# EAGLE design Openlapse2.6 (EAGLE 7.6.0)
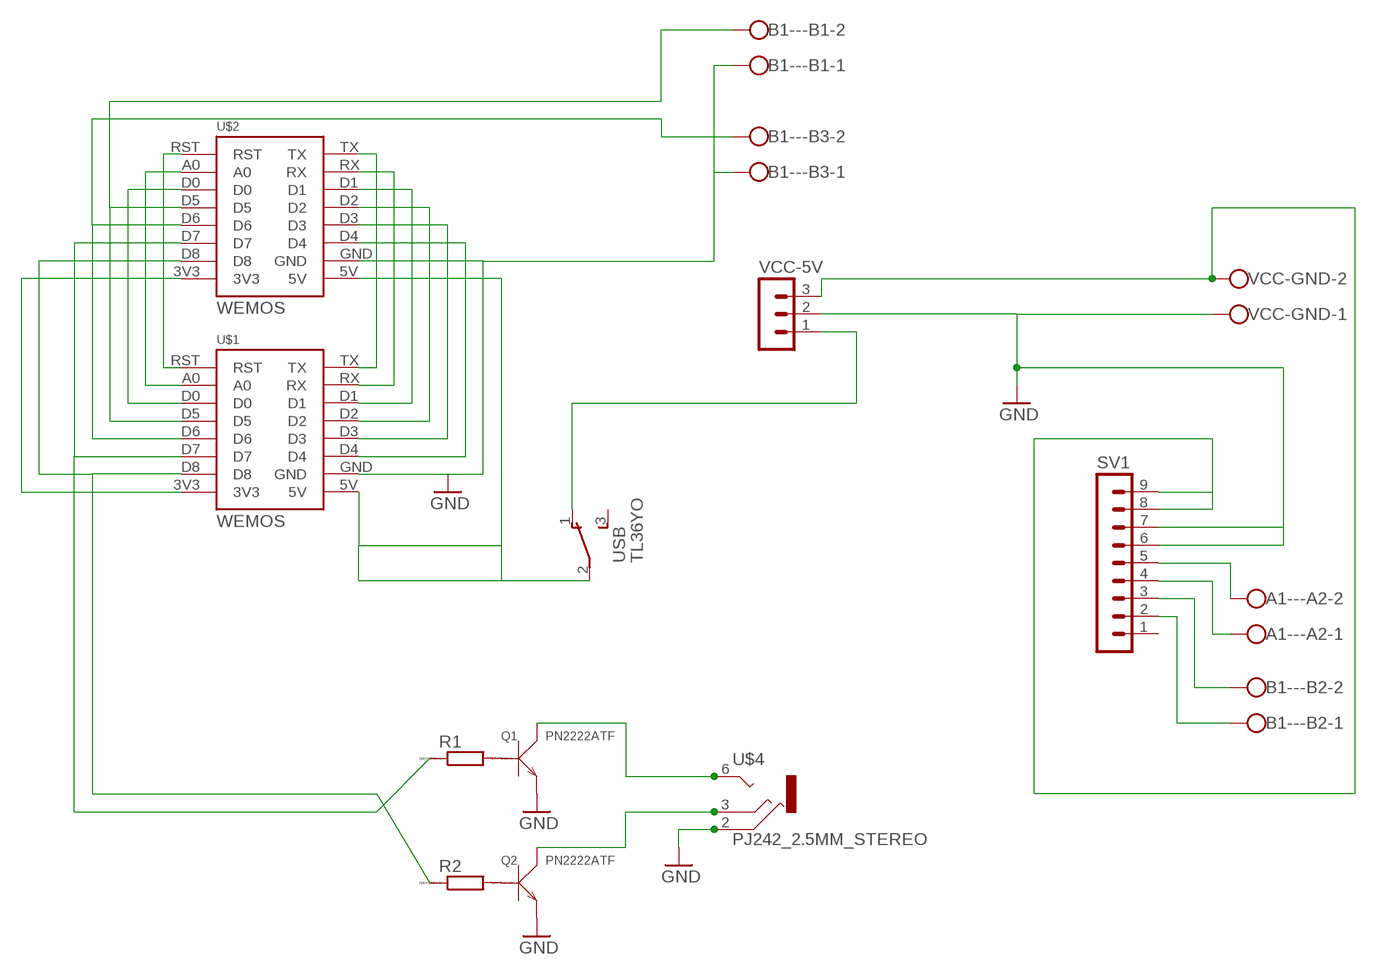
[diagram p0: schematic, sheet 1]

## Parts
A1---A2  W237-102  [W237-102]
B1---B1  W237-102  [W237-102]
B1---B2  W237-102  [W237-102]
B1---B3  W237-102  [W237-102]
Q1  PN2222ATF  DIP-TRANS-NPN-40V-1A-PN2222ATF(TO-92)  [TO-92]
Q2  PN2222ATF  DIP-TRANS-NPN-40V-1A-PN2222ATF(TO-92)  [TO-92]
R1  R0204/7  [0204/7]
R2  R0204/7  [0204/7]
SV1  MA09-1  [MA09-1]
U$1  WEMOS  [WEMOS]
U$2  WEMOS  [WEMOS]
U$4  PJ242_2.5MM_STEREO  [PJ242_2.5MM_STEREO]
USB  TL36YO  [TL3XYO]
VCC-5V  MA03-1  [MA03-1]
VCC-GND  W237-102  [W237-102]

## Nets
GND: B1---B1.1 B1---B3.1 Q1.1(E) Q2.1(E) SV1.6 SV1.7 U$1.GND U$2.GND U$4.2 VCC-5V.2 VCC-GND.1
N$1: SV1.8 SV1.9 VCC-5V.3 VCC-GND.2
N$2: U$1.5V U$2.5V USB.2(P)
N$3: R2.1 U$1.D8 U$2.D8
N$4: R1.1 U$1.D7 U$2.D7
N$5: U$1.TX U$2.TX
N$6: U$1.RX U$2.RX
N$7: Q2.2(B) R2.2
N$8: Q1.2(B) R1.2
N$9: U$1.D1 U$2.D1
N$10: U$1.D2 U$2.D2
N$11: U$1.D3 U$2.D3
N$12: U$1.D4 U$2.D4
N$13: U$1.RST U$2.RST
N$14: U$1.A0 U$2.A0
N$15: U$1.D0 U$2.D0
N$16: B1---B1.2 U$1.D5 U$2.D5
N$17: B1---B3.2 U$1.D6 U$2.D6
N$18: Q1.3(C) U$4.6
N$20: USB.1(O) VCC-5V.1
N$21: U$1.3V3 U$2.3V3
N$22: A1---A2.2 SV1.5
N$23: A1---A2.1 SV1.4
N$24: Q2.3(C) U$4.3
N$25: B1---B2.2 SV1.3
N$26: B1---B2.1 SV1.2
Unconnected: SV1.1 USB.3(S)

## Library data of the parts
A1---A2 B1---B1-B1---B3 VCC-GND = con-wago-500:W237-102: WAGO SCREW CLAMP; MPN: 237-102; OC_FARNELL: unknown; OC_NEWARK: 70K9898
Q1 Q2 = Seeed-OPL-Transistor:DIP-TRANS-NPN-40V-1A-PN2222ATF(TO-92): 305010023; MPN: PN2222ATF
R1 R2 = eagle-ltspice:R: RESISTOR, European symbol; SPICEMODEL: NONE; SPICEPREFIX: R
SV1 = con-lstb:MA09-1: PIN HEADER; OC_FARNELL: unknown; OC_NEWARK: unknown
U$1 U$2 = wemos:WEMOS
U$4 = daves_bits:PJ242_2.5MM_STEREO
USB = switch:TL36YO: TINY SWITCH ON - ON Source: http://www2.produktinfo.conrad.com/datenblaetter/700000-724999/705152-da-01-de-Subminiaturschalter_TL_36YO.pdf
VCC-5V = con-lstb:MA03-1: PIN HEADER; OC_FARNELL: unknown; OC_NEWARK: unknown

## Net classes
0 default: clearance 0.205 mm

## Board
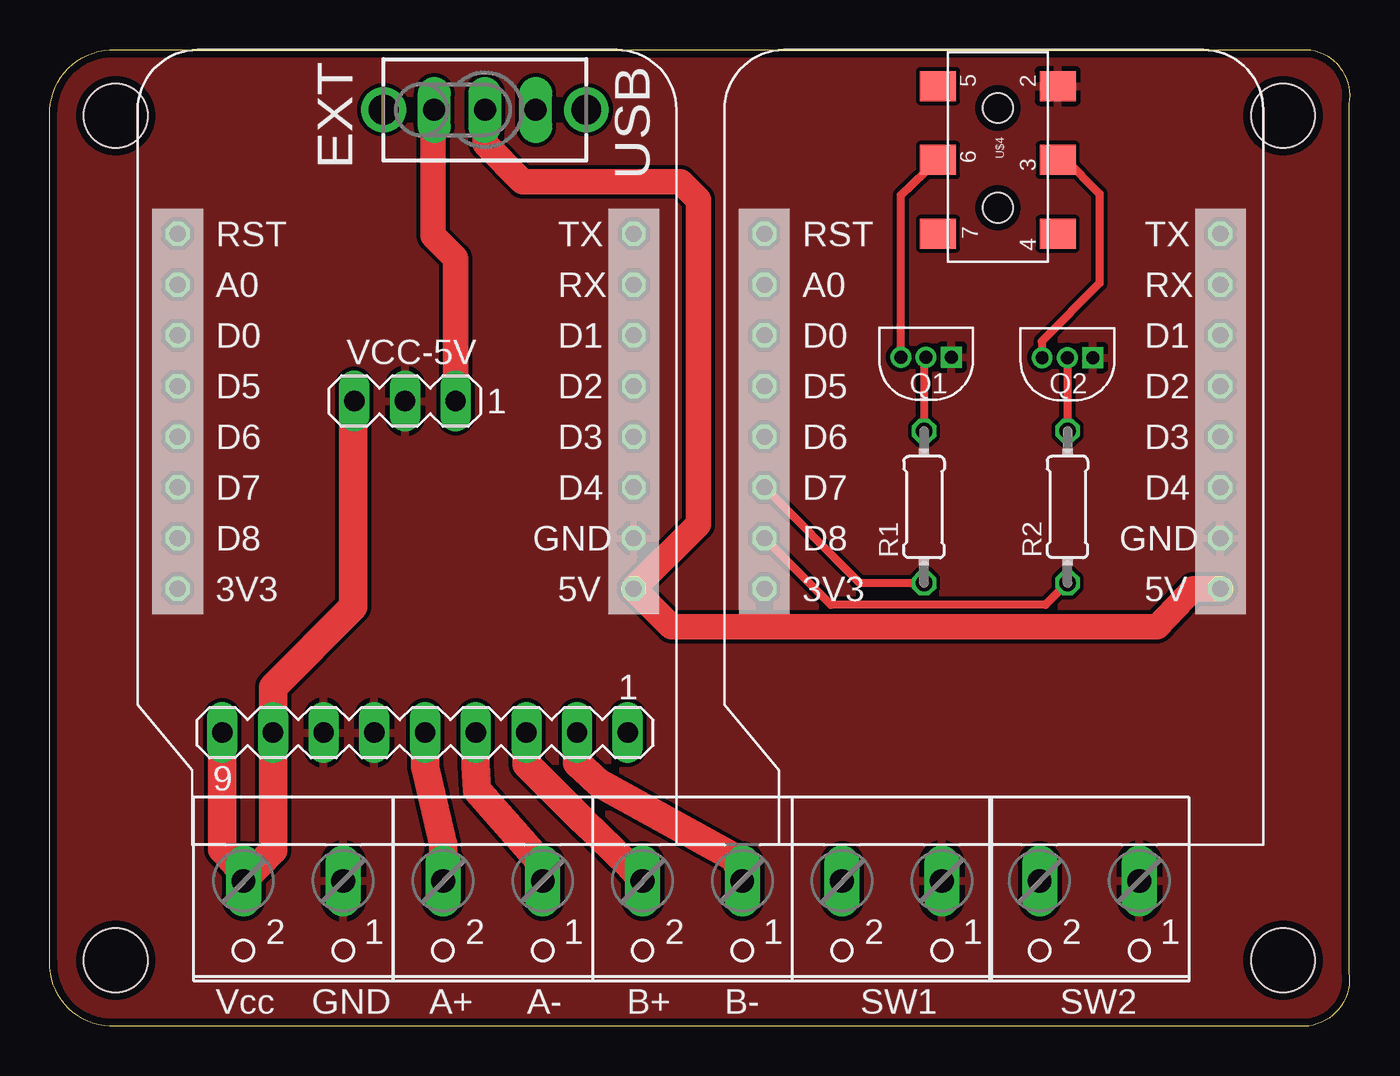
[diagram p1: board, top side]
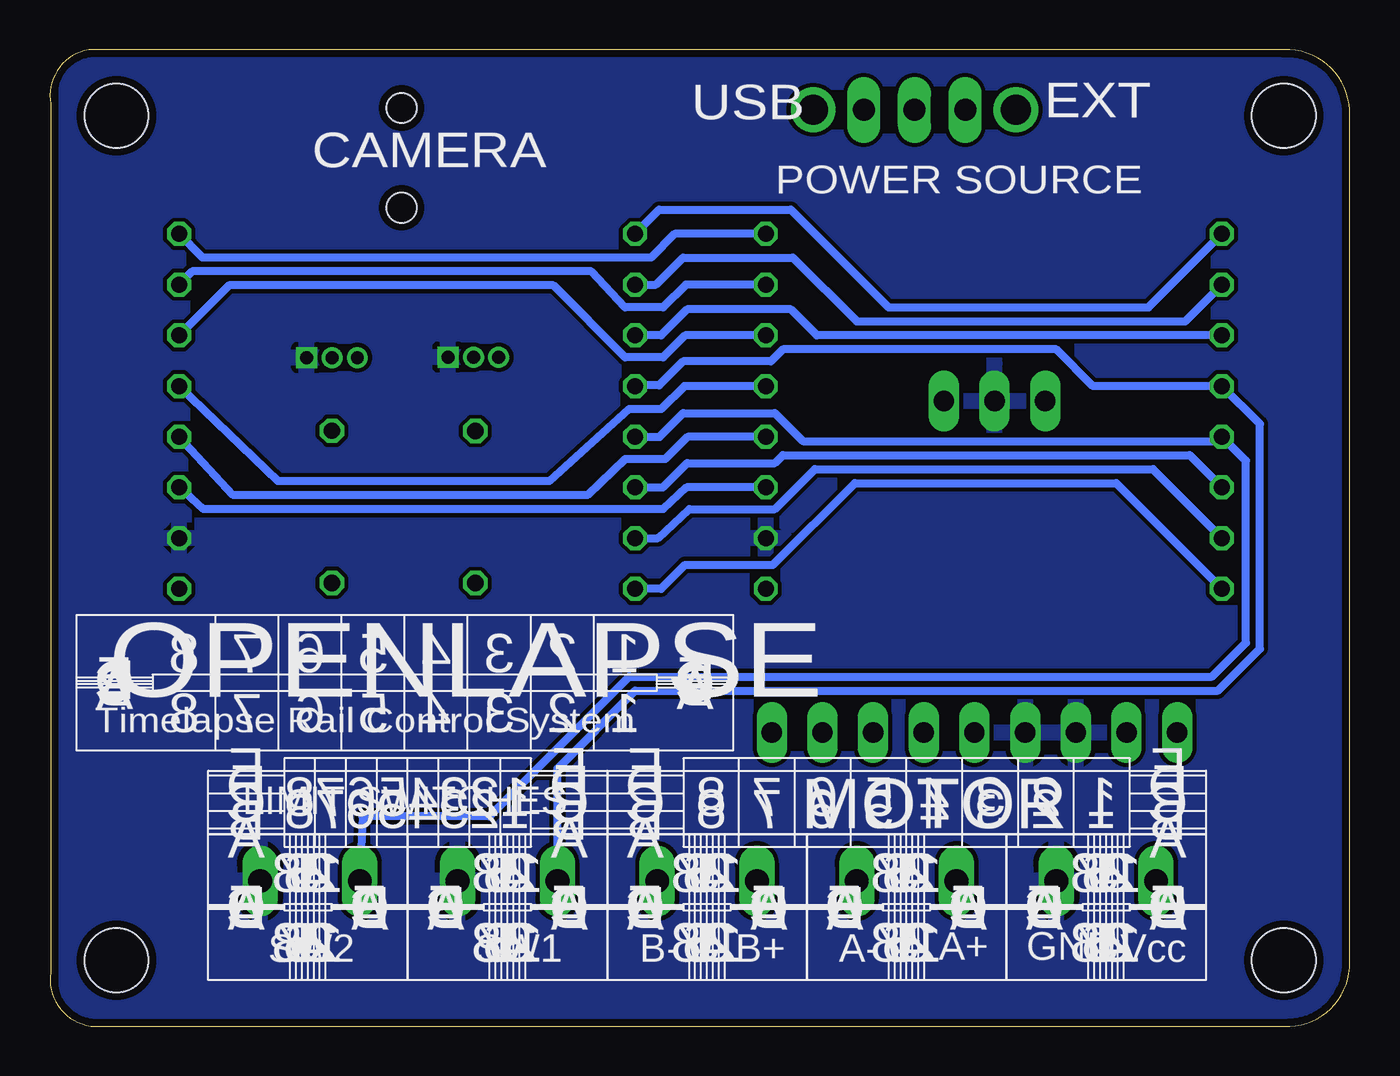
[diagram p2: board, bottom side, seen from below]

Size 65.13 x 48.9 mm. Coordinates in mm from the lower left corner, seen from the top.
Outline: 0,45.9 arc-90 3.3,48.9 63.2,48.9 arc-90 65.1,46.2 65.1,2.7 arc-90 63.1,0 3,0 arc-90 0,3.2 0,45.9
Copper layers (1*16): Top 0.0356mm / dielectric 1.5011mm / Bottom 0.0356mm
Design rules "OSHPARKLaenPCBOrder": minimum track width 6mil, minimum drill 13mil, track to track 6mil, track to pad 6mil, pad to pad 6mil, via to via 6mil, smd to smd 6mil, copper to edge 15mil, drill to drill 6mil, minimum pad ring 7mil, minimum via ring 7mil, stop-mask expansion 3mil, vias tented up to drill 0mil, thermal gap 10mil
Holes 3.2 mm at 3.3,3.3 61.8,3.3 61.8,45.6 3.3,45.6

### Footprints (pad centres in the part's own frame; a part is rotated, then mirrored left to right if it is on the bottom)
W237-102 = drill 1.194 long: 1 -2.5,-1.27; 2 2.5,-1.27
TO-92 = drill 0.65 pad 1.05 square: 1 -1.27,0 | drill 0.65 pad 1.05: 2 0,0; 3 1.27,0
0204/7 = drill 0.813 octagon: 1 -3.81,0; 2 3.81,0
MA09-1 = drill 1.016 long: 1 -10.16,0; 2 -7.62,0; 3 -5.08,0; 4 -2.54,0; 5 0,0; 6 2.54,0; 7 5.08,0; 8 7.62,0; 9 10.16,0
WEMOS = drill 0.8 octagon: 3V3 0,0; 5V 22.86,0; A0 0,15.24; D0 0,12.7; D1 22.86,12.7; D2 22.86,10.16; D3 22.86,7.62; D4 22.86,5.08; D5 0,10.16; D6 0,7.62; D7 0,5.08; D8 0,2.54; GND 22.86,2.54; RST 0,17.78; RX 22.86,15.24; TX 22.86,17.78
PJ242_2.5MM_STEREO = smd 1.5 x 1.8: 2 1.7,5.5; 3 5.4,5.5; 4 9.1,5.5; 5 1.7,-0.5; 6 5.4,-0.5; 7 9.1,-0.5 | hole 1.5: 2.8,2.5; 7.8,2.5
TL3XYO = drill 1.1 pad 1.422 long: 1 -2.54,0; 2 0,0; 3 2.54,0 | drill 1.5 pad 2.184: M1 -5.08,0; M2 5.08,0
MA03-1 = drill 1.016 long: 1 -2.54,0; 2 0,0; 3 2.54,0

### Placement (x,y rotation side)
A1---A2  22.2,6 180 top
B1---B1  42.2,6 180 top
B1---B2  32.2,6 180 top
B1---B3  52.1,6 180 top
Q1  43.91,33.51 180 top
Q2  51,33.49 180 top
R1  43.81,26 90 top
R2  51,26.01 90 top
SV1  18.8,14.7 180 top
U$1  6.4,21.9 0 top
U$2  35.8,21.9 0 top
U$4  45.01,48.79 270 top
USB  21.8,45.9 0 top
VCC-5V  17.79,31.31 180 top
VCC-GND  12.2,6 180 top

### Tracks (layer width: path | path; a pad name or v marks a point on that pad's centre or on a via)
GND
  pour Bottom: 0.16,48.84 65.24,48.89 65.22,-0.06 -0.36,-0.11
  pour Top: 0.15,49.08 65.08,48.84 65.17,-0.04 -0.03,0.3
N$1
  Top 1.422: SV1.9 8.64,8.86 9.9,7.4 9.67,7.3 VCC-GND.2 11.2,8.8 11.18,12.22 SV1.8 11.18,16.98 15.2,21 15.2,31.26 VCC-5V.3
N$2
  Top 1.27: USB.2 21.8,44.2 23.7,42.3 31.6,42.3 32.5,41.4 32.5,25.14 U$1.5V 31.16,20 55.5,20 57.3,21.9 U$2.5V
N$3
  Top 0.406: R2.1 49.9,21.1 39.14,21.1 U$2.D8
  Bottom 0.406: U$2.D8 34.66,24.44 33.1,25.9 28.8,25.9 26.8,27.9 9.86,27.9 U$1.D8
N$4
  Top 0.406: R1.1 40.59,22.19 U$2.D7
  Bottom 0.406: U$2.D7 34.42,26.98 33.2,28.2 28.8,28.2 28.4,28.6 8.02,28.6 U$1.D7
N$5
  Top 0.406: U$2.TX
  Bottom 0.406: U$1.TX 33.82,39.68 35,38.5 57.48,38.5 U$2.TX
N$6
  Top 0.406: U$2.RX
  Bottom 0.406: U$1.RX 33.26,37.14 34.4,36 36.3,36 38,37.8 58,37.8 U$2.RX
N$7
  Top 0.406: Q2.2 R2.2
N$8
  Top 0.406: Q1.2 43.81,33.51 R1.2
N$9
  Bottom 0.406: U$1.D1 33.3,34.6 34.4,33.5 36.3,33.5 39.9,37.1 56.16,37.1 U$2.D1
N$10
  Bottom 0.406: U$1.D2 33.34,32.06 34.5,30.9 36.1,30.9 40.1,27.3 53.7,27.3 U$2.D2
N$11
  Bottom 0.406: U$1.D3 33.18,29.52 34.3,28.4 36.3,28.4 38.2,26.6 55.94,26.6 U$2.D3
N$12
  Bottom 0.406: U$1.D4 33.22,26.98 34.4,25.9 57.44,25.9 U$2.D4
N$13
  Bottom 0.406: U$2.RST 35.8,39.7 34.6,40.9 28,40.9 23.1,36 10.08,36 U$1.RST 6.42,39.7
N$14
  Bottom 0.406: U$2.A0 34.76,37.14 33.4,38.5 27.9,38.5 24.7,35.3 8.24,35.3 U$1.A0 6.46,37.2
N$15
  Bottom 0.406: U$1.D0 26.7,34.6 28,35.9 33.2,35.9 34.5,34.6 U$2.D0
N$16
  Bottom 0.406: U$2.D5 35.76,32.1 34.6,32.1 33.4,33.3 29,33.3 28.4,33.9 14.7,33.9 12.86,32.06 U$1.D5 4.5,30.16 4.5,18.9 6.6,16.8 35.8,16.8 39.7,12.9 B1---B1.2
N$17
  Bottom 0.406: B1---B3.2 49.47,10.5 43.1,10.5 36.1,17.5 6.9,17.5 5.2,19.2 5.2,28.32 U$1.D6 6.62,29.3 27.4,29.3 28.8,30.7 33.4,30.7 34.58,29.52 U$2.D6
N$18
  Top 0.406: Q1.3 42.64,41.62 U$4.6
N$20
  Top 1.27: 20.3,31.31 VCC-5V.1 20.33,38.47 19.2,39.6 19.2,46.14 USB.1
N$21
  Bottom 0.406: U$2.3V3 34.5,21.9 33.3,23.1 28.9,23.1 24.8,27.2 11.7,27.2 U$1.3V3
N$22
  Top 1.422: SV1.5 18.8,13 19.7,9.1 A1---A2.2
N$23
  Top 1.422: SV1.4 21.34,13.06 21.4,11.8 24.77,8 A1---A2.1
N$24
  Top 0.406: U$4.3 50.81,43.49 52.6,41.7 52.6,37.2 49.7,34.3 49.7,33.52 Q2.3
N$25
  Top 1.422: SV1.3 23.88,13.12 26.7,10.3 29.07,8 B1---B2.2
N$26
  Top 1.422: SV1.2 26.42,13.18 27.5,12.2 34.37,8.4 B1---B2.1

### Text on the board
tPlace: EXT | USB | Q1 | Q2 | Vcc | GND | A+ | A- | B+ | B- | SW1 | SW2
bPlace: EXT | USB | CAMERA | POWER SOURCE | OPENLAPSE | Timelapse Rail Control System | LIMIT SWITCHES | MOTOR | Vcc | GND | A+ | A- | B+ | B- | SW1 | SW2
Notes: GND | G7 | SCLK | MISO | G25 | MOSI | GND | 3v3 | G24 | G22 | G23 | G21 | GND | G17 | G18 | GND | G15 | G4 | G14 | SCL | GND | SDA | 5V | 3v3 | 5V